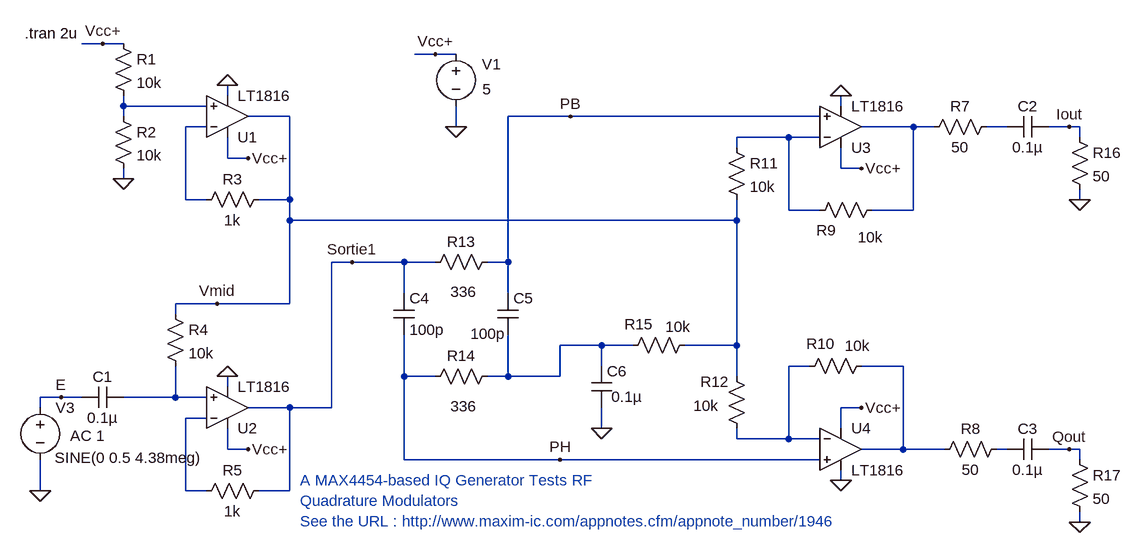
[diagram p0: schematic Iq_Genr_Lt1816.asc]
Iq_Genr_Lt1816.asc, the LTspice schematic file:
Version 4
SHEET 1 1648 680
WIRE -32 -160 -64 -160
WIRE 0 -160 -32 -160
WIRE 480 -144 448 -144
WIRE 512 -144 480 -144
WIRE 160 -80 160 -96
WIRE 0 -64 0 -80
WIRE 128 -64 0 -64
WIRE 1104 -64 1104 -80
WIRE 0 -48 0 -64
WIRE 256 -48 192 -48
WIRE 688 -48 592 -48
WIRE 1072 -48 688 -48
WIRE 128 -32 96 -32
WIRE 512 -32 512 -64
WIRE 1216 -32 1136 -32
WIRE 1248 -32 1216 -32
WIRE 1360 -32 1328 -32
WIRE 1456 -32 1424 -32
WIRE 1472 -32 1456 -32
WIRE 1024 -16 944 -16
WIRE 1072 -16 1024 -16
WIRE 1472 -16 1472 -32
WIRE 944 0 944 -16
WIRE 160 16 160 -16
WIRE 192 16 160 16
WIRE 1104 32 1104 0
WIRE 1136 32 1104 32
WIRE 0 48 0 32
WIRE 96 80 96 -32
WIRE 128 80 96 80
WIRE 256 80 256 -48
WIRE 256 80 208 80
WIRE 1472 80 1472 64
WIRE 1024 96 1024 -16
WIRE 1072 96 1024 96
WIRE 1216 96 1216 -32
WIRE 1216 96 1152 96
WIRE 256 112 256 80
WIRE 944 112 944 80
WIRE 944 112 256 112
WIRE 352 176 320 176
WIRE 432 176 352 176
WIRE 480 176 432 176
WIRE 592 176 592 -48
WIRE 592 176 560 176
WIRE 432 224 432 176
WIRE 592 224 592 176
WIRE 144 240 80 240
WIRE 256 240 256 112
WIRE 256 240 144 240
WIRE 80 256 80 240
WIRE 736 304 672 304
WIRE 784 304 736 304
WIRE 944 304 944 112
WIRE 944 304 864 304
WIRE 736 336 736 304
WIRE 1056 336 1024 336
WIRE 1200 336 1136 336
WIRE 432 352 432 288
WIRE 480 352 432 352
WIRE 592 352 592 288
WIRE 592 352 560 352
WIRE 672 352 672 304
WIRE 672 352 592 352
WIRE 944 352 944 304
WIRE 160 368 160 352
WIRE -96 384 -128 384
WIRE -64 384 -96 384
WIRE 80 384 80 336
WIRE 80 384 0 384
WIRE 128 384 80 384
WIRE -128 400 -128 384
WIRE 256 400 192 400
WIRE 320 400 320 176
WIRE 320 400 256 400
WIRE 1136 400 1104 400
WIRE 128 416 96 416
WIRE 736 432 736 400
WIRE 1104 432 1104 400
WIRE 944 448 944 432
WIRE 1024 448 1024 336
WIRE 1024 448 944 448
WIRE 1072 448 1024 448
WIRE 160 464 160 432
WIRE 192 464 160 464
WIRE 1200 464 1200 336
WIRE 1200 464 1136 464
WIRE 1264 464 1200 464
WIRE 1360 464 1344 464
WIRE 1456 464 1424 464
WIRE 1472 464 1456 464
WIRE 432 480 432 352
WIRE 672 480 432 480
WIRE 1072 480 672 480
WIRE 1472 480 1472 464
WIRE 1104 512 1104 496
WIRE -128 528 -128 480
WIRE 96 528 96 416
WIRE 128 528 96 528
WIRE 256 528 256 400
WIRE 256 528 208 528
WIRE 1472 576 1472 560
FLAG 0 48 0
FLAG 144 240 Vmid
FLAG -32 -160 Vcc+
FLAG 736 432 0
FLAG 512 -32 0
FLAG 480 -144 Vcc+
FLAG 192 16 Vcc+
FLAG 192 464 Vcc+
FLAG 1136 32 Vcc+
FLAG 1136 400 Vcc+
FLAG -128 528 0
FLAG 1472 80 0
FLAG 1472 576 0
FLAG 1456 -32 Iout
FLAG 1456 464 Qout
FLAG 160 -96 0
FLAG 1104 -80 0
FLAG 1104 512 0
FLAG 160 352 0
FLAG -96 384 E
FLAG 688 -48 PB
FLAG 672 480 PH
FLAG 352 176 Sortie1
SYMBOL res -16 -176 R0
SYMATTR InstName R1
SYMATTR Value 10k
SYMBOL res -16 -64 R0
SYMATTR InstName R2
SYMATTR Value 10k
SYMBOL res 64 240 R0
SYMATTR InstName R4
SYMATTR Value 10k
SYMBOL cap 0 368 R90
WINDOW 0 0 32 VBottom 0
WINDOW 3 32 32 VTop 0
SYMATTR InstName C1
SYMATTR Value 0.1µ
SYMBOL res 1344 -48 R90
WINDOW 0 0 56 VBottom 0
WINDOW 3 32 56 VTop 0
SYMATTR InstName R7
SYMATTR Value 50
SYMBOL res 1360 448 R90
WINDOW 0 0 56 VBottom 0
WINDOW 3 32 56 VTop 0
SYMATTR InstName R8
SYMATTR Value 50
SYMBOL cap 1424 -48 R90
WINDOW 0 0 32 VBottom 0
WINDOW 3 32 32 VTop 0
SYMATTR InstName C2
SYMATTR Value 0.1µ
SYMBOL cap 1424 448 R90
WINDOW 0 0 32 VBottom 0
WINDOW 3 32 32 VTop 0
SYMATTR InstName C3
SYMATTR Value 0.1µ
SYMBOL res 1168 80 R90
WINDOW 0 63 86 VBottom 0
WINDOW 3 42 18 VTop 0
SYMATTR InstName R9
SYMATTR Value 10k
SYMBOL res 1152 320 R90
WINDOW 0 -3 79 VBottom 0
WINDOW 3 -31 22 VTop 0
SYMATTR InstName R10
SYMATTR Value 10k
SYMBOL res 928 -16 R0
SYMATTR InstName R11
SYMATTR Value 10k
SYMBOL res 928 336 R0
WINDOW 0 -40 24 Left 0
WINDOW 3 -51 61 Left 0
SYMATTR InstName R12
SYMATTR Value 10k
SYMBOL res 576 160 R90
WINDOW 0 0 56 VBottom 0
WINDOW 3 46 52 VTop 0
SYMATTR InstName R13
SYMATTR Value 336
SYMBOL res 576 336 R90
WINDOW 0 0 56 VBottom 0
WINDOW 3 46 52 VTop 0
SYMATTR InstName R14
SYMATTR Value 336
SYMBOL cap 416 224 R0
SYMATTR InstName C4
SYMATTR Value 100p
SYMBOL cap 576 224 R0
WINDOW 3 -42 62 Left 0
SYMATTR Value 100p
SYMATTR InstName C5
SYMBOL res 880 288 R90
WINDOW 0 -1 87 VBottom 0
WINDOW 3 -28 26 VTop 0
SYMATTR InstName R15
SYMATTR Value 10k
SYMBOL cap 720 336 R0
WINDOW 3 31 47 Left 0
SYMATTR Value 0.1µ
SYMATTR InstName C6
SYMBOL voltage 512 -160 R0
WINDOW 0 40 32 Left 0
WINDOW 3 41 70 Left 0
WINDOW 123 0 0 Left 0
WINDOW 39 0 0 Left 0
SYMATTR InstName V1
SYMATTR Value 5
SYMBOL voltage -128 384 R0
WINDOW 123 46 59 Left 0
WINDOW 39 0 0 Left 0
WINDOW 3 22 93 Left 0
SYMATTR Value2 AC 1
SYMATTR Value SINE(0 0.5 4.38meg)
SYMATTR InstName V3
SYMBOL res 1456 -32 R0
SYMATTR InstName R16
SYMATTR Value 50
SYMBOL res 1456 464 R0
SYMATTR InstName R17
SYMATTR Value 50
SYMBOL Opamps\\LT1816 160 400 M180
SYMATTR InstName U2
SYMBOL Opamps\\LT1816 160 -48 M180
SYMATTR InstName U1
SYMBOL Opamps\\LT1816 1104 -32 M180
SYMATTR InstName U3
SYMBOL Opamps\\LT1816 1104 464 R0
SYMATTR InstName U4
SYMBOL res 224 64 R90
WINDOW 0 0 56 VBottom 0
WINDOW 3 32 56 VTop 0
SYMATTR InstName R3
SYMATTR Value 1k
SYMBOL res 224 512 R90
WINDOW 0 0 56 VBottom 0
WINDOW 3 32 56 VTop 0
SYMATTR InstName R5
SYMATTR Value 1k
TEXT -152 -176 Left 0 !.tran 2u
TEXT 272 512 Left 0 ;A MAX4454-based IQ Generator Tests RF\nQuadrature Modulators\nSee the URL : http://www.maxim-ic.com/appnotes.cfm/appnote_number/1946

The netlist it stands for:
* Iq_Genr_Lt1816.asc
R1 Vcc+ N001 10k
R2 N001 0 10k
R4 Vmid N009 10k
C1 N009 E 0.1µ
R7 N004 N003 50
R8 N011 N008 50
C2 Iout N004 0.1µ
C3 Qout N011 0.1µ
R9 N003 N005 10k
R10 N008 N007 10k
R11 N005 Vmid 10k
R12 Vmid N007 10k
R13 PB Sortie1 336
R14 N006 PH 336
C4 Sortie1 PH 100p
C5 PB N006 100p
R15 Vmid N006 10k
C6 N006 0 0.1µ
V1 Vcc+ 0 5
V3 E 0 SINE(0 0.5 4.38meg) AC 1
R16 Iout 0 50
R17 Qout 0 50
* U2: LT1816 (symbol Opamps\LT1816 not available, pins judged from their places): In+=N009 In-=N010 V+=Vcc+ V-=0 OUT=Sortie1
* U1: LT1816 (symbol Opamps\LT1816 not available, pins judged from their places): In+=N001 In-=N002 V+=Vcc+ V-=0 OUT=Vmid
* U3: LT1816 (symbol Opamps\LT1816 not available, pins judged from their places): In+=PB In-=N005 V+=Vcc+ V-=0 OUT=N003
* U4: LT1816 (symbol Opamps\LT1816 not available, pins judged from their places): In+=PH In-=N007 V+=Vcc+ V-=0 OUT=N008
R3 Vmid N002 1k
R5 Sortie1 N010 1k
.tran 2u
* A MAX4454-based IQ Generator Tests RF
* Quadrature Modulators
* See the URL : http://www.maxim-ic.com/appnotes.cfm/appnote_number/1946
.backanno
.end